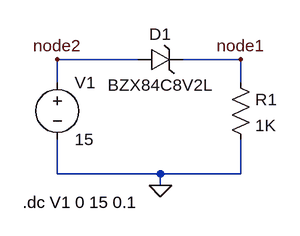
[diagram p0: schematic Draft10.asc]
Draft10.asc, the LTspice schematic file:
Version 4
SHEET 1 880 680
WIRE 144 80 32 80
WIRE 288 80 208 80
WIRE 32 112 32 80
WIRE 288 112 288 80
WIRE 32 240 32 192
WIRE 176 240 32 240
WIRE 288 240 288 192
WIRE 288 240 176 240
WIRE 176 256 176 240
FLAG 176 256 0
FLAG 288 80 node1
FLAG 32 80 node2
SYMBOL res 272 96 R0
SYMATTR InstName R1
SYMATTR Value 1K
SYMBOL zener 144 96 R270
WINDOW 0 36 32 VTop 2
WINDOW 3 -4 32 VBottom 2
SYMATTR InstName D1
SYMATTR Value BZX84C8V2L
SYMATTR Description Diode
SYMATTR Type diode
SYMBOL voltage 32 96 R0
WINDOW 123 0 0 Left 0
WINDOW 39 0 0 Left 0
SYMATTR InstName V1
SYMATTR Value 15
TEXT -16 280 Left 2 !.dc V1 0 15 0.1

The netlist it stands for:
* Draft10.asc
R1 node1 0 1K
D1 node2 node1 BZX84C8V2L
V1 node2 0 15
.model D D
.lib standard.dio
.dc V1 0 15 0.1
.backanno
.end